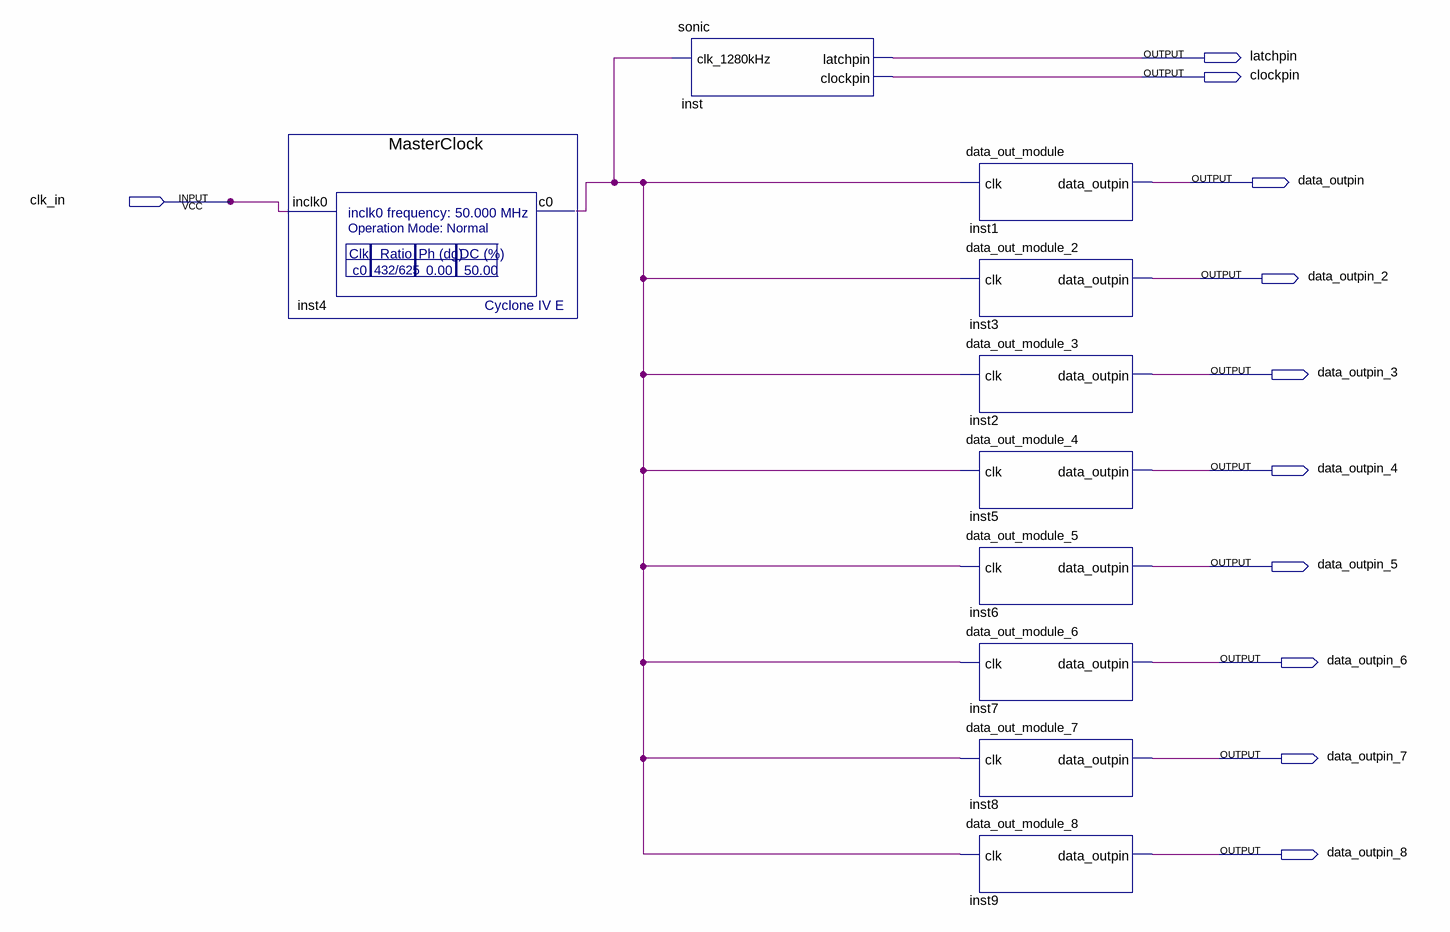
[diagram p0: schematic sheet]
// Quartus schematic Block1.bdf as structural Verilog: 10 symbols, 11 pins
module Block1 (
  input  clk_in,
  output latchpin,
  output clockpin,
  output data_outpin,
  output data_outpin_2,
  output data_outpin_3,
  output data_outpin_4,
  output data_outpin_5,
  output data_outpin_6,
  output data_outpin_7,
  output data_outpin_8
);

  wire inst4_c0;

  MasterClock inst4 (.inclk0(clk_in), .c0(inst4_c0));
  sonic inst (.clk_1280kHz(inst4_c0), .latchpin(latchpin), .clockpin(clockpin));
  data_out_module inst1 (.clk(inst4_c0), .data_outpin(data_outpin));
  data_out_module_2 inst3 (.clk(inst4_c0), .data_outpin(data_outpin_2));
  data_out_module_3 inst2 (.clk(inst4_c0), .data_outpin(data_outpin_3));
  data_out_module_4 inst5 (.clk(inst4_c0), .data_outpin(data_outpin_4));
  data_out_module_5 inst6 (.clk(inst4_c0), .data_outpin(data_outpin_5));
  data_out_module_6 inst7 (.clk(inst4_c0), .data_outpin(data_outpin_6));
  data_out_module_7 inst8 (.clk(inst4_c0), .data_outpin(data_outpin_7));
  data_out_module_8 inst9 (.clk(inst4_c0), .data_outpin(data_outpin_8));
endmodule
